# EAGLE design Quad512K (EAGLE 6.4)
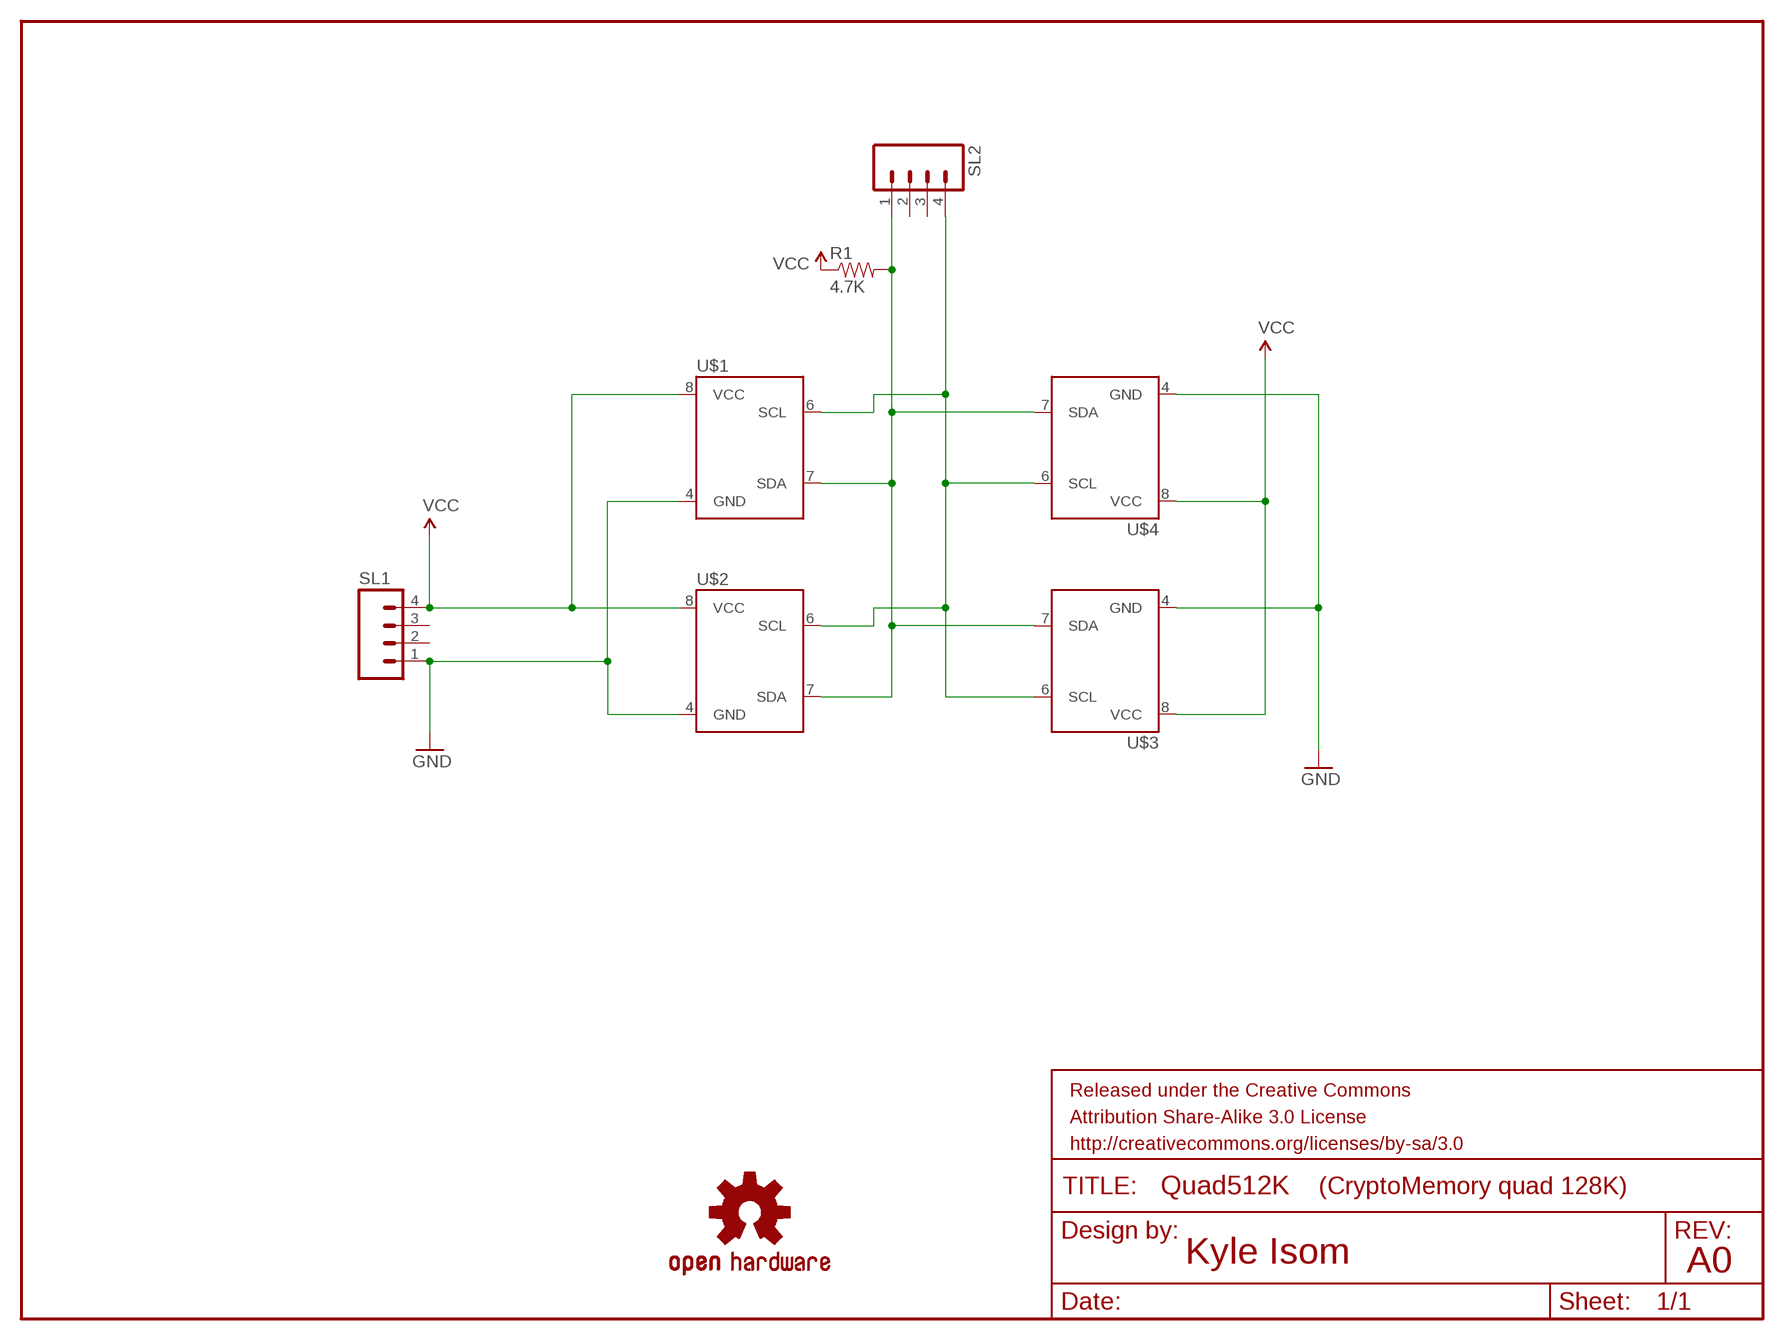
[diagram p0: schematic, sheet 1]

## Parts
FRAME1  FRAME-LETTER  [CREATIVE_COMMONS]
LOGO1  OSHW-LOGOS  [OSHW-LOGO-S]
R1  4.7K  RESISTORPTH-1/4W  [AXIAL-0.4]
SL1  M04LOCK  [1X04_LOCK]
SL2  M04LOCK  [1X04_LOCK]
U$1  AT88SCAT88SC-PDIP  [DIL08]
U$2  AT88SCAT88SC-PDIP  [DIL08]
U$3  AT88SCAT88SC-PDIP  [DIL08]
U$4  AT88SCAT88SC-PDIP  [DIL08]

## Nets
GND: SL1.1 U$1.4(GND) U$2.4(GND) U$3.4(GND) U$4.4(GND)
N$1: SL2.4 U$1.6(SCL) U$2.6(SCL) U$3.6(SCL) U$4.6(SCL)
N$2: R1.P$2 SL2.1 U$1.7(SDA) U$2.7(SDA) U$3.7(SDA) U$4.7(SDA)
VCC: R1.P$1 SL1.4 U$1.8(VCC) U$2.8(VCC) U$3.8(VCC) U$4.8(VCC)
Unconnected: SL1.2 SL1.3 SL2.2 SL2.3

## Notes on the sheet
- (CryptoMemory quad 128K)
- Kyle Isom | A0

## Library data of the parts
FRAME1 = SparkFun-Aesthetics:FRAME-LETTER: Schematic Frame Standard 8.5x11 US Letter frame
LOGO1 = SparkFun-Aesthetics:OSHW-LOGO: Open Source Hardware Logo This logo indicates the piece of hardware it is found on incorporates a OSHW license and/or adheres to the definition of open source hardware found here: http://freedomdefined.org/OSHW
R1 = SparkFun-Passives:RESISTOR: Resistor Basic schematic elements and footprints for 0603, 1206, and PTH resistors.
SL1 SL2 = SparkFun-Connectors:M04: Header 4 Standard 4-pin 0.1" header. Use with straight break away headers (SKU : PRT-00116), right angle break away headers (PRT-00553), swiss pins (PRT-00743), machine pins (PRT-00117), and female headers (PRT-00115). Molex polarized connector foot print use with SKU : PRT-08231 with associated crimp pins and housings. 1MM SMD Version SKU: PRT-10208
U$1-U$4 = EEPROM:AT88SC

## Board
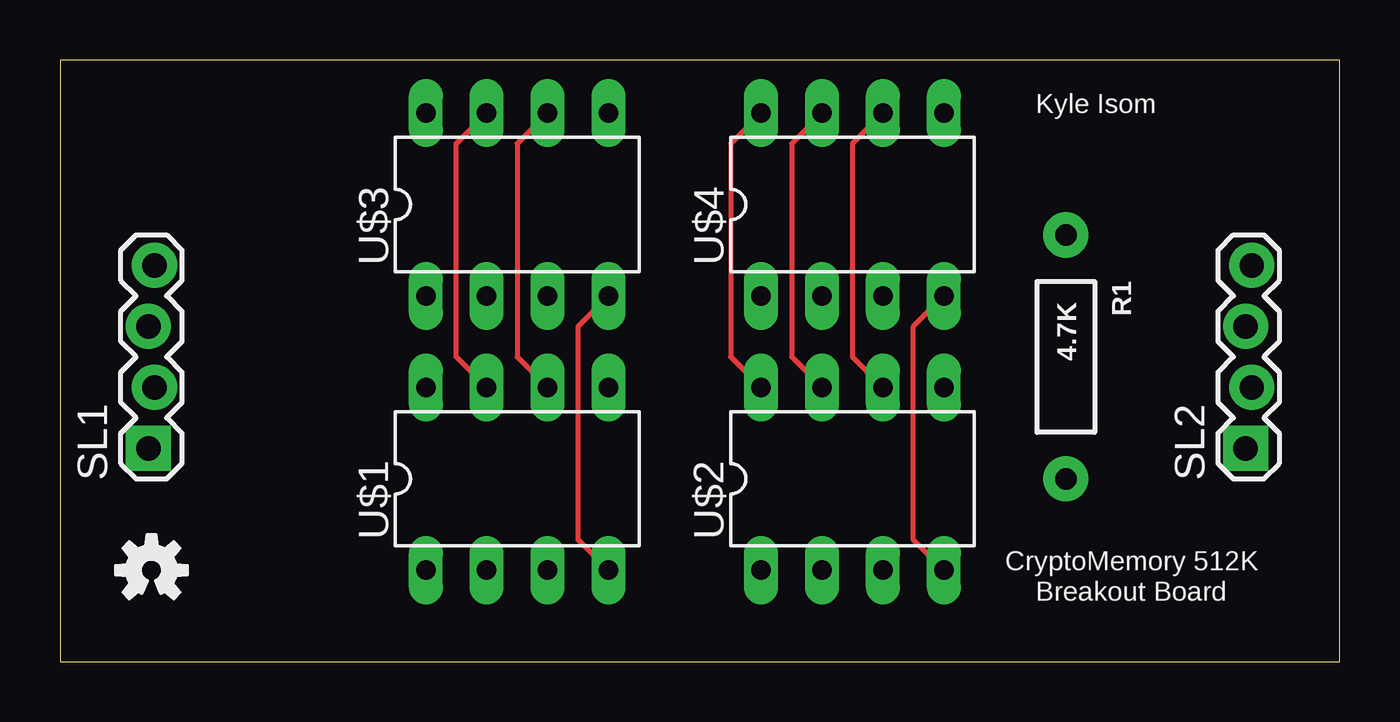
[diagram p1: board, top side]
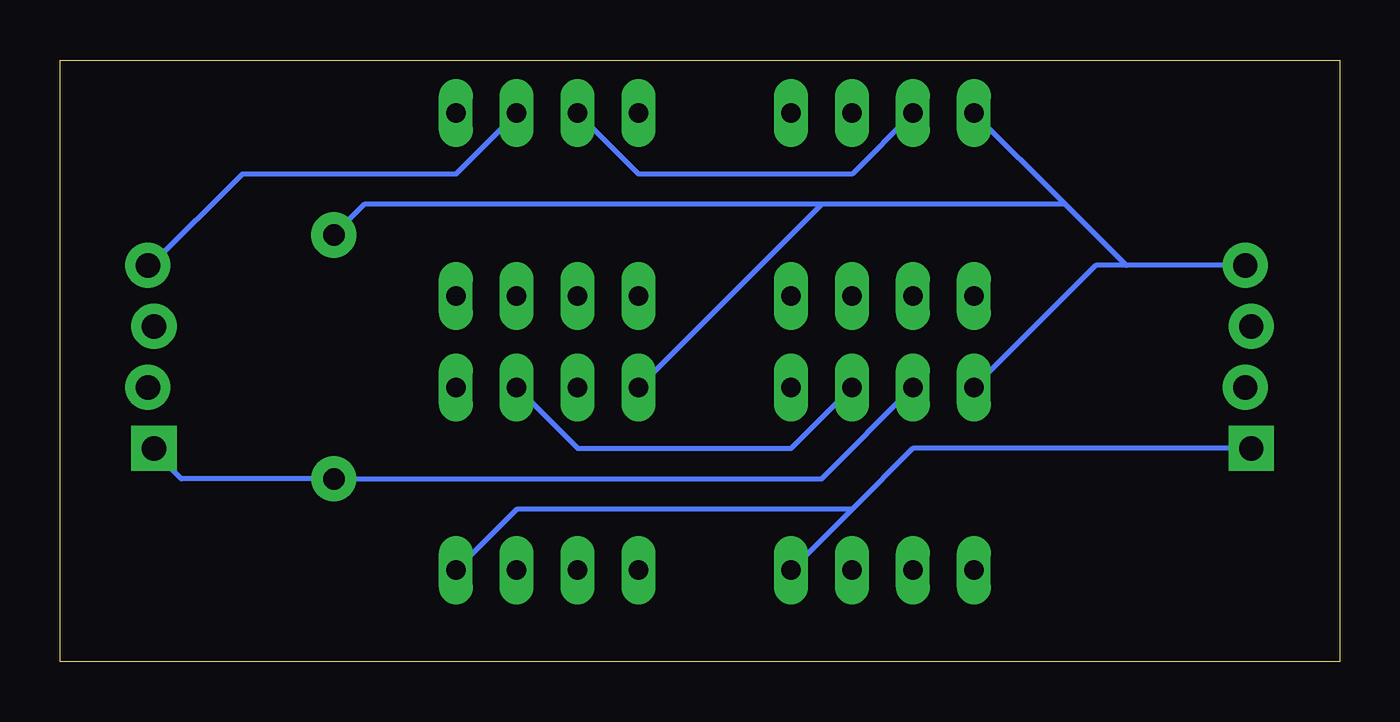
[diagram p2: board, bottom side, seen from below]

Size 53.32 x 25.07 mm. Coordinates in mm from the lower left corner, seen from the top.
Outline: 0,0 53.32,0 53.32,25.07 0,25.07 0,0
Copper layers (1*16): Top 0.035mm / dielectric 1.5mm / Bottom 0.035mm
Design rules "SparkFun": minimum track width 8mil, minimum drill 20mil, track to track 8mil, track to pad 8mil, pad to pad 8mil, via to via 8mil, smd to smd 8mil, copper to edge 10mil, drill to drill 8mil, minimum pad ring 12mil, minimum via ring 10mil, stop-mask expansion 4mil, vias tented up to drill 25mil, thermal gap 10mil

### Footprints (pad centres in the part's own frame; a part is rotated, then mirrored left to right if it is on the bottom)
AXIAL-0.4 = drill 0.9 pad 1.88: P$1 -5.08,0; P$2 5.08,0
1X04_LOCK = drill 1.016 pad 1.88 square: 1 0,0.127 | drill 1.016 pad 1.88: 2 2.54,-0.127; 3 5.08,0.127; 4 7.62,-0.127
DIL08 = drill 0.813 long: 1 -3.81,-3.81; 2 -1.27,-3.81; 3 1.27,-3.81; 4 3.81,-3.81; 5 3.81,3.81; 6 1.27,3.81; 7 -1.27,3.81; 8 -3.81,3.81

### Placement (x,y rotation side)
FRAME1  3.81,-10.16 0 top  (outside the outline)
LOGO1  3.81,3.81 0 top
R1  41.91,12.7 270 top
SL1  3.81,8.89 90 top
SL2  49.53,8.89 90 top
U$1  19.05,7.62 0 top
U$2  33.02,7.62 0 top
U$3  19.05,19.05 0 top
U$4  33.02,19.05 0 top

### Tracks (layer width: path | path; a pad name or v marks a point on that pad's centre or on a via)
GND
  Top 0.203: U$3.4 21.59,13.97 21.59,5.08 U$1.4 | U$4.4 35.56,13.97 35.56,5.08 U$2.4
  Bottom 0.203: 20.32,6.35 17.78,8.89 SL1.1 | 20.32,6.35 U$1.4 | U$2.4 34.29,6.35 20.32,6.35
N$1
  Top 0.203: U$1.6 19.05,12.7 19.05,21.59 U$3.6 | U$2.6 33.02,12.7 33.02,21.59 U$4.6
  Bottom 0.203: U$4.6 36.83,20.32 45.72,20.32 49.53,16.51 SL2.4 | U$1.6 22.86,8.89 31.75,8.89 U$2.6
N$2
  Top 0.203: U$2.7 30.48,12.7 30.48,21.59 U$4.7 | U$3.7 16.51,21.59 16.51,12.7 U$1.7
  Bottom 0.203: U$1.7 21.59,7.62 R1.P$2 48.26,7.62 49.53,8.89 SL2.1 | U$4.7 29.21,20.32 20.32,20.32 U$3.7
VCC
  Top 0.203: U$2.8 27.94,12.7 27.94,21.59 U$4.8
  Bottom 0.203: U$1.8 10.16,16.51 8.89,16.51 | 8.89,16.51 SL1.4 3.81,16.51 | 8.89,16.51 11.43,19.05 | 11.43,19.05 U$3.8 | R1.P$1 40.64,19.05 21.59,19.05 | 11.43,19.05 21.59,19.05 | 21.59,19.05 U$2.8

### Text on the board
tPlace: Kyle Isom | CryptoMemory 512K | Breakout Board